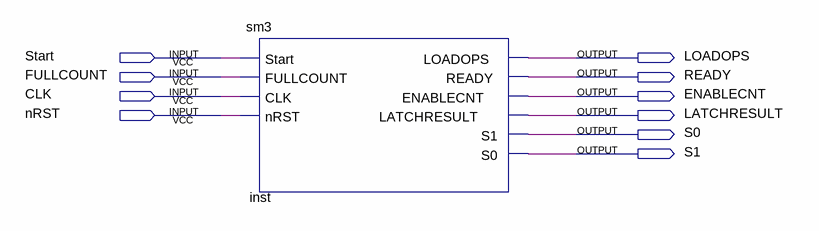
[diagram p0: schematic sheet]
// Quartus schematic SM.bdf as structural Verilog: 1 symbols, 10 pins
module SM (
  input  Start,
  input  FULLCOUNT,
  input  CLK,
  input  nRST,
  output LOADOPS,
  output READY,
  output ENABLECNT,
  output LATCHRESULT,
  output S0,
  output S1
);

  sm3 inst (
    .Start(Start), .FULLCOUNT(FULLCOUNT), .CLK(CLK), .nRST(nRST), .LOADOPS(LOADOPS), .READY(READY),
    .ENABLECNT(ENABLECNT), .LATCHRESULT(LATCHRESULT), .S1(S0), .S0(S1));
endmodule
